# Altium schematic sheet Power Switch.SchDoc
size A; SheetNumber: 6; SheetTotal: 12
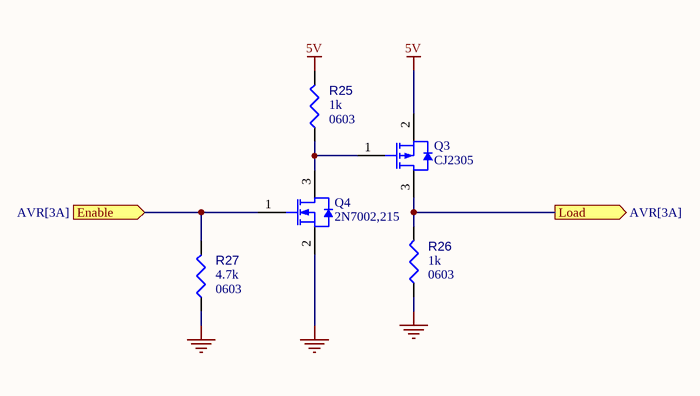
[diagram p0: Power Switch.SchDoc]

## Parts
Q3  CJ2305  [JSCJ-SOT23-3_V]
Q4  2N7002,215  [NXP-SOT23-3_V]
R25  value 1k  Case/Package: 0603  [RESC1608X55X25ML10T15]  (hidden comment: Resistor 1k +/-1% 0603 100 mW)
R26  value 1k  Case/Package: 0603  [RESC1608X55X25ML10T15]  (hidden comment: Resistor 1k +/-1% 0603 100 mW)
R27  value 4.7k  Case/Package: 0603  [RESC1608X55X25ML10T15]  (hidden comment: Resistor 1k +/-1% 0603 100 mW)

## Ports
Enable (in, see AVR[3A]), Load (out, see AVR[3A])

## Nets
5V: Q3.2(SOURCE) R25.2
GND: Q4.2(S) R26.1 R27.1
Enable: Q4.1(G) R27.2 ; port Enable
Load: Q3.3(DRAIN) R26.2 ; port Load
NetQ3_1: Q3.1(GATE) Q4.3(D) R25.1

## Library data of the parts
Q3 = CMP-013-00015-3: P-Channel Plastic Encapsulate MOSFET, 12 V, 4.1 A, 3-Pin SOT23, Tape and Reel; Manufacturer: Jiangsu Changjiang Electronics Technology; Package Version: Rev. E, 09/2009; Datasheet URL: http://www.cj-elec.com/gallery/txUpfile/5140ba9ed47d18467ea4bddc055cd747.pdf; Case/Package: SOT23-3; Mounting Technology: SM; RoHS Compliant: Unknown; Datasheet Version: Rev. F, 04/2015; Package Description: 3-Pin Small Outline Transistor, Body 2.9 x 1.3 mm, Pitch 0.95 mm; Package Reference: SOT23-3
Q4 = CMP-013-00011-4: N-channel Trench MOSFET, 60 V, 300 mA, -65 to 150 degC, 3-Pin SOT-23 (TO-236AB), RoHS, Tape and Reel; Manufacturer: NXP Semiconductors; Elements: 1; Power: 830mW; Max Dual Supply Voltage: 60V; Rds On Max: 5Ohm; Package Version: Feb-16; Nominal Vgs: 2V; Input Capacitance: 50pF; RoHS Compliant: True; Datasheet URL: http://www.nxp.com/documents/data_sheet/2N7002.pdf; Packaging: TapeandReel; Case/Package: TO-236-3; Package Reference: SOT23-3; Max Operating Temperature: 150°C; Pins: 8; Mounting Technology: SM; Package Quantity: 1; Datasheet Version: Rev. 7, 09/2011; Nominal Dual Supply Voltage: 60V; Min Operating Temperature: -65°C; Package Description: 3-Pin Small Outline Transistor, Body 1.3 x 2.9 mm, Pitch 0.95 mm; Vds Max: 60V
R25-R27 = CMP-009-00014-5: Chip Resistor, 1 KOhm, +/-1%, 0.1 W, -55 to 155 degC, 0603 (1608 Metric); Voltage Rating: 50V; Power: 100mW; Tolerance: 1%; Mounting Technology: SM; Pins: 2; Min Operating Temperature: -55°C; RoHS Compliant: True; Max Operating Temperature: 155°C